# Altium schematic sheet USB_OTG_FS.SchDoc: USB_OTG_FS
size A4; DocumentNumber: MB1167; Revision: B.1; SheetNumber: 9; SheetTotal: 17; Project: STM327x6G-EVAL
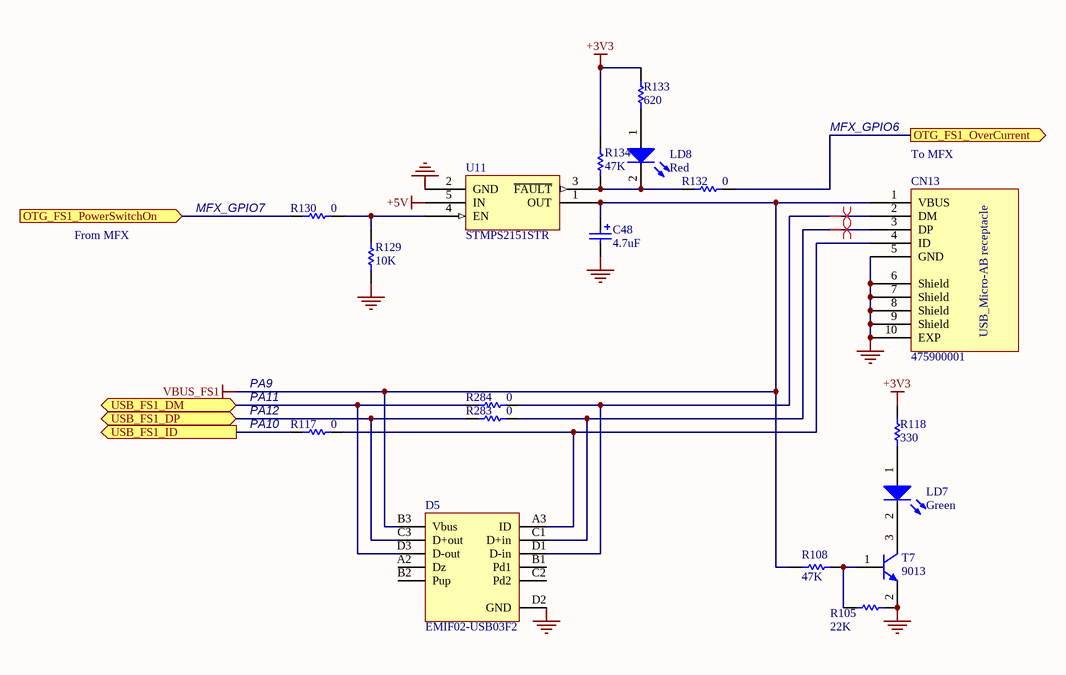
[diagram p0: USB_OTG_FS.SchDoc]

## Parts
C48  4.7uF  [TAN-A]
CN13  475900001  [MOLEX_47590001]
D5  EMIF02-USB03F2  [BGA11_0R5_1R57X2R07]
LD7  Green  [0603D]
LD8  Red  [0603D]
R105  22K  [0603R]
R108  47K  [0603R]
R117  0  [0603R]
R118  330  [0603R]
R129  10K  [0603R]
R130  0  [0603R]
R132  0  [0603R]
R133  620  [0603R]
R134  47K  [0603R]
R283  0  [0603R]
R284  0  [0603R]
T7  9013  [SOT-23]
U11  STMPS2151STR  [SOT23-5]

## Ports
OTG_FS1_OverCurrent (out), OTG_FS1_PowerSwitchOn (in), USB_FS1_DM (bidir), USB_FS1_DP (bidir), USB_FS1_ID (out)

## Nets
+3V3: R118.2 R133.2 R134.1
+5V: U11.5(IN)
GND: C48.2 CN13.5(GND) CN13.6(Shield) CN13.7(Shield) CN13.8(Shield) CN13.9(Shield) CN13.10(EXP) D5.D2(GND) R105.1 R129.1 T7.2(E) U11.2(GND)
VBUS_FS1: C48.1 CN13.1(VBUS) D5.B3(Vbus) R108.1 U11.1(OUT)
OTG_FS1_OverCurrent: R132.1 ; port OTG_FS1_OverCurrent
OTG_FS1_PowerSwitchOn: R130.2 ; port OTG_FS1_PowerSwitchOn
USB_FS1_DM: D5.D3(D-out) R284.2 ; port USB_FS1_DM
USB_FS1_DP: D5.C3(D+out) R283.2 ; port USB_FS1_DP
USB_FS1_ID: R117.2 ; port USB_FS1_ID
NetCN13_2: CN13.2(DM) D5.D1(D-in) R284.1
NetCN13_3: CN13.3(DP) D5.C1(D+in) R283.1
NetCN13_4: CN13.4(ID) D5.A3(ID) R117.1
NetLD7_1: LD7.1(A) R118.1
NetLD7_2: LD7.2(K) T7.3(C)
NetLD8_1: LD8.1(A) R133.1
NetLD8_2: LD8.2(K) R132.2 R134.2 U11.3(~{FAULT})
NetR105_2: R105.2 R108.2 T7.1(B)
NetR129_2: R129.2 R130.1 U11.4(EN)

Not connected (* = marked no-connect by the designer): D5 A2(Dz) B1(Pd1) B2(Pup) C2(Pd2)

## Layout directives
differential pair: NetCN13_2, NetCN13_3

## Notes on the sheet
- MFX_GPIO6
- (near R130) MFX_GPIO7
- (near CN13) To MFX
- From MFX
- PA9
- (near R117) PA11
- (near R117) PA12
- (near R117) PA10
- Title:
- Project:
- Size:
- Date:
- A4
- Reference:
- Sheet:
- Revision:
- of
- (in symbol 475900001) USB_Micro-AB receptacle

## Library data of the parts
C48 = Cap Pol1: Polarized Capacitor (Radial); Value: 47uF; Published: 8-Jun-2000; Revision: July-2002: Re-released for DXP Platform.; Publisher: Altium Limited
LD7 LD8 = LED2: Typical RED, GREEN, YELLOW, AMBER GaAs LED; Published: 8-Jun-2000; Revision: July-2002: Re-released for DXP Platform.; Publisher: Altium Limited
R105 R108 R118 R134 = res1: Resistor; Value: 1K; Published: 8-Jun-2000; Revision: July-2002: Re-released for DXP Platform.; Publisher: Altium Limited
R117 R129 R130 R132 R133 R283 R284 = Res1: Resistor; Value: 1K; Published: 8-Jun-2000; Revision: July-2002: Re-released for DXP Platform.; Publisher: Altium Limited
T7 = NPN: NPN Bipolar Transistor; Code - JEDEC: TO-226-AA; Published: 8-Jun-2000; Revision: July-2002: Re-released for DXP Platform.; Publisher: Altium Limited
U11 = STMPS2141STR